# EAGLE design MRCS-Tiny-Servo-Pots (EAGLE 7.7.0)
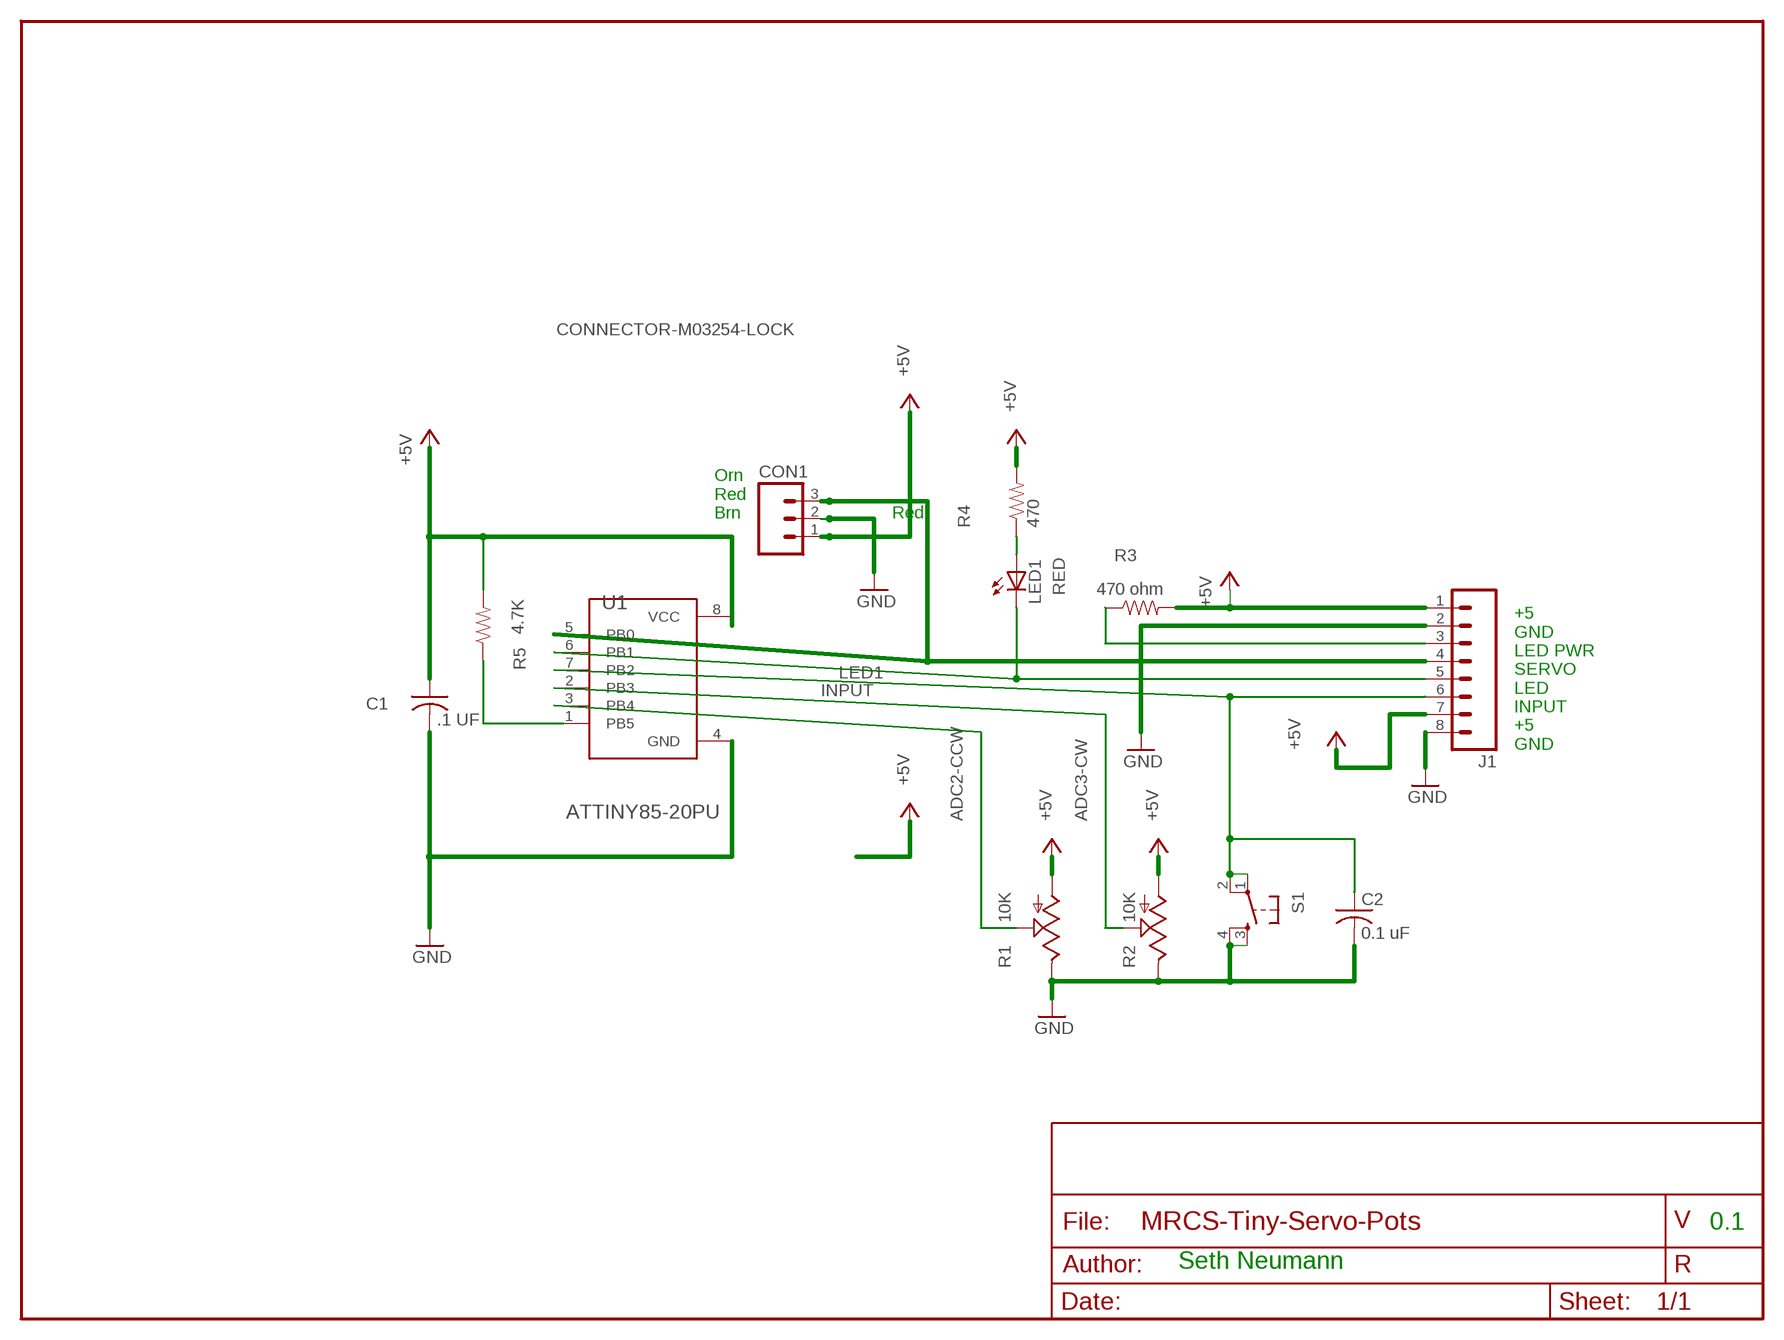
[diagram p0: schematic, sheet 1]

## Parts
C1  .1 UF  CAPPTH2  [C-PTH-0.100]
C2  0.1 uF  CAPPTH2  [C-PTH-0.100]
CON1  CONNECTOR-M03254-LOCK  [3POL254]
J1  CONNECTOR-M08LOCK  [1X08_LOCK]
LED1  RED  LEDLED3MM  [LED3MM]
R1  10K  TRIM_US-RS3  [RS3]
R2  10K  TRIM_US-RS3  [RS3]
R3  470 ohm  RPTH04  [AXIAL-0.4-RES]
R4  470  RPTH04  [AXIAL-0.4-RES]
R5  4.7K  RPTH04  [AXIAL-0.4-RES]
S1  TAC_SWITCHPTH  [TACTILE-PTH]
U1  ATTINY85-20PU  [DIP762W46P254L927H533Q8B]

## Nets
+5V: C1.1 CON1.1 J1.1 J1.7 R1.A R2.A R3.P$2 R4.P$2 R5.P$2
ADC2-CCW: R1.S U1.3(PB4)
ADC3-CW: R2.S U1.2(PB3)
GND: C1.2 C2.2 CON1.2 J1.2 J1.8 R1.E R2.E S1.3 S1.4 U1.4(GND)
INPUT: C2.1 J1.6 S1.1 S1.2 U1.7(PB2)
LED1: J1.5 LED1.K(C) U1.6(PB1)
N$1: J1.3 R3.P$1
N$2: LED1.A R4.P$1
N$3: R5.P$1
N$4: CON1.3 J1.4 U1.5(PB0)
Unconnected: U1.1(PB5)

## Notes on the sheet
- Orn
  Red
  Brn
- Red
- +5
  GND
  LED PWR
  SERVO
  LED
  INPUT
  +5
  GND
- 0.1
- Seth Neumann

## Power pins joined to a net without a drawn wire
VCC: U1.8(VCC)

## Library data of the parts
C1 C2 = SPCoast:CAP*
CON1 = SPCoast:CONNECTOR-M03
J1 = SPCoast:CONNECTOR-M08: Header 8 Standard 8-pin 0.1" header. Use with straight break away headers (SKU : PRT-00116), right angle break away headers (PRT-00553), swiss pins (PRT-00743), machine pins (PRT-00117), and female headers (PRT-00115).
LED1 = SPCoast:LED*
R1 R2 = pot:TRIM_US-: POTENTIOMETER
R3-R5 = SPCoast:R*: Resistor Basic schematic elements and footprints for 0603, 1206, and PTH 1/10th watt (small) resistors.
S1 = SparkFun-Electromechanical:TAC_SWITCH: Momentary Switch Button commonly used for reset or general input. Spark Fun Electronics SKU : COM-00097 SMT- SWCH-08247
U1 = ATTINY85-20PU:ATTINY85-20PU: ATtiny Series 20 MHz 8 KB Flash 512 B SRAM 8-Bit Microcontroller - DIP-8 Check availability <https://pricing.snapeda.com/parts/ATTINY85-20PU/Microchip%20Technology%20/%20Atmel/view-part?ref=eda>; AVAILABILITY: In Stock; DESCRIPTION: AVR AVR® ATtiny, Functional Safety (FuSa) Microcontroller IC 8-Bit 20MHz 8KB (4K x 16) FLASH 8-PDIP; MF: Microchip Technology / Atmel; MP: ATTINY85-20PU; PACKAGE: None; PRICE: None; PURCHASE-URL: https://pricing.snapeda.com/search/part/ATTINY85-20PU/?ref=eda

## Board
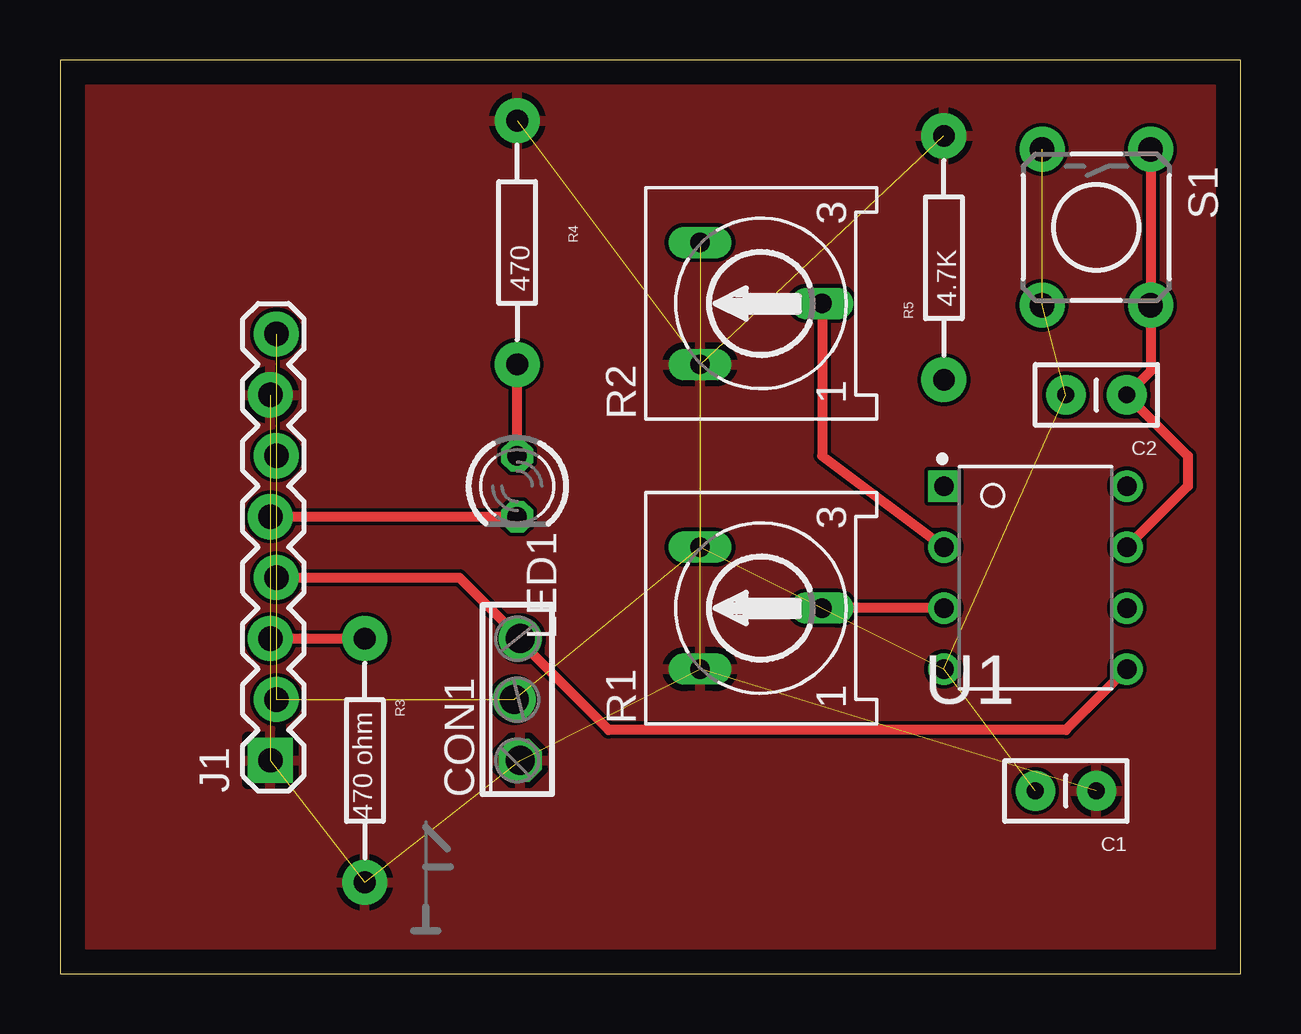
[diagram p1: board, top side]
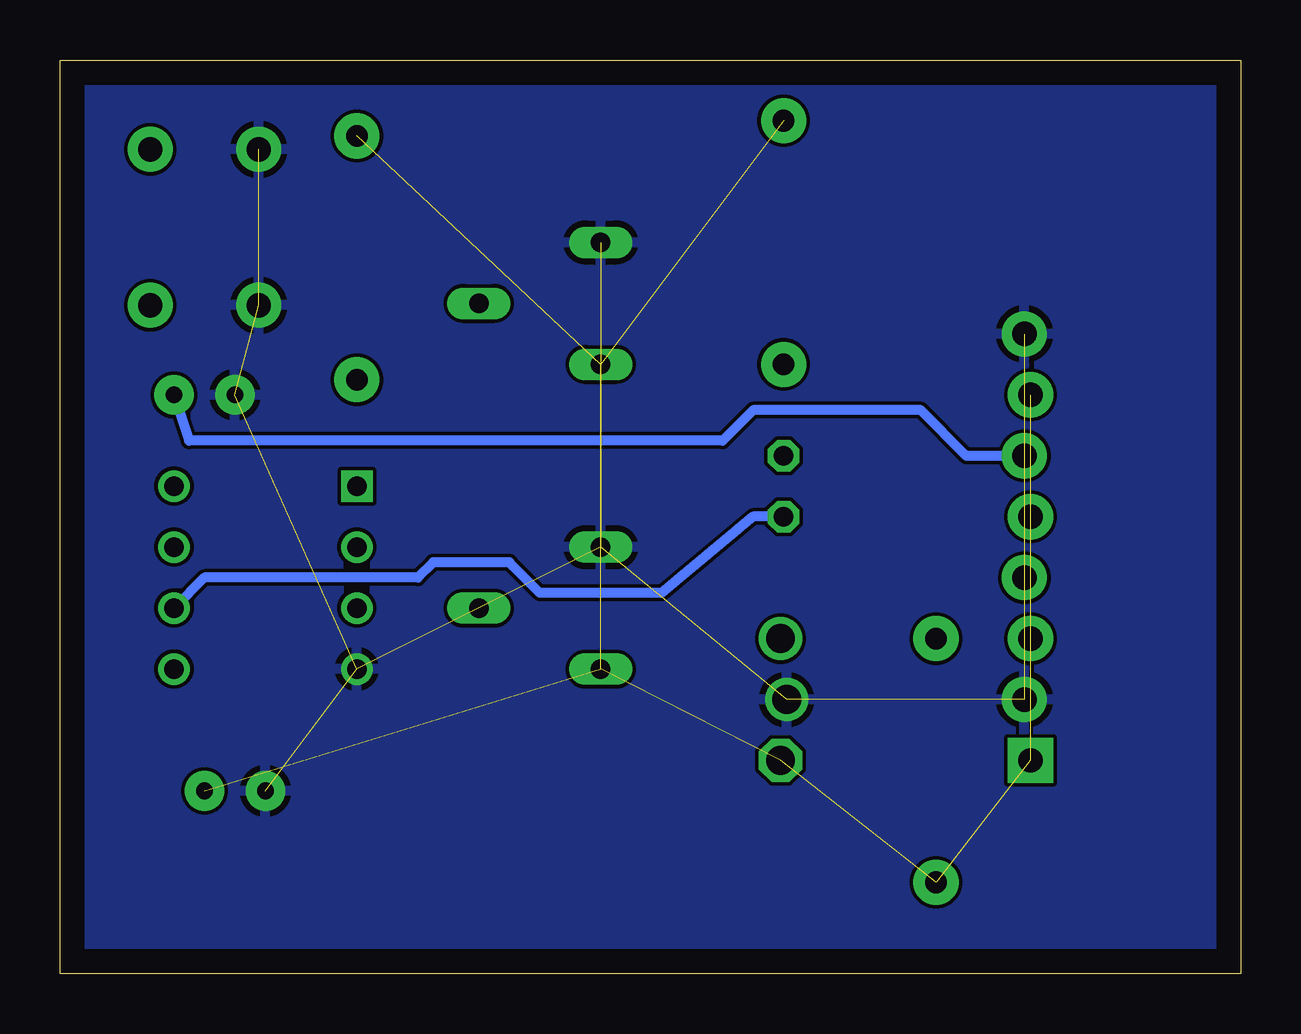
[diagram p2: board, bottom side, seen from below]

Size 49.2 x 38.09 mm. Coordinates in mm from the lower left corner, seen from the top.
Outline: 0,0 49.2,0 49.2,38.09 0,38.09 0,0
Copper layers (1*16): Top 0.035mm / dielectric 1.5mm / Bottom 0.035mm
Design rules "default": minimum track width 6mil, minimum drill 0.35mm, track to track 6mil, track to pad 6mil, pad to pad 6mil, via to via 6mil, smd to smd 6mil, copper to edge 40mil, drill to drill 6mil, minimum pad ring 10mil, minimum via ring 8mil, stop-mask expansion 4mil, vias tented up to drill 0mil, thermal gap 10mil

### Footprints (pad centres in the part's own frame; a part is rotated, then mirrored left to right if it is on the bottom)
C-PTH-0.100 = drill 0.7 pad 1.651: 1 -1.27,0; 2 1.27,0
3POL254 = drill 1.2 octagon: 1 -2.54,-0.127 | drill 1.2: 2 0,0.127; 3 2.54,-0.127
1X08_LOCK = drill 1.016 pad 1.88 square: 1 0,0.127 | drill 1.016 pad 1.88: 2 2.54,-0.127; 3 5.08,0.127; 4 7.62,-0.127; 5 10.16,0.127; 6 12.7,-0.127; 7 15.24,0.127; 8 17.78,-0.127
LED3MM = drill 0.813 octagon: A 1.27,0; K -1.27,0
RS3 = drill 0.813 long: A -2.54,2.54; E 2.54,2.54; S 0,-2.54
AXIAL-0.4-RES = drill 0.9 pad 1.88: P$1 -5.08,0; P$2 5.08,0
TACTILE-PTH = drill 1.016 pad 1.88: 1 -3.251,2.261; 2 3.251,2.261; 3 -3.251,-2.261; 4 3.251,-2.261
DIP762W46P254L927H533Q8B = drill 0.813 square: 1 -3.81,3.81 | drill 0.813: 2 -3.81,1.27; 3 -3.81,-1.27; 4 -3.81,-3.81; 5 3.81,-3.81; 6 3.81,-1.27; 7 3.81,1.27; 8 3.81,3.81

### Placement (x,y rotation side)
C1  41.91,7.62 180 top
C2  43.18,24.13 180 top
CON1  19.05,11.43 90 top
J1  8.89,8.89 90 top
LED1  19.05,20.32 90 top
R1  29.21,15.24 90 top
R2  29.21,27.94 90 top
R3  12.7,8.89 270 top
R4  19.05,30.48 90 top
R5  36.83,29.84 90 top
S1  43.18,31.11 270 top
U1  40.64,16.51 0 top
U$1  [MRCSLOGOTOP]  13.97,1.27 0 top

### Tracks (layer width: path | path; a pad name or v marks a point on that pad's centre or on a via)
+5V  (8 unrouted)
  pour Top: 0,0 49.53,0 49.53,38.1 0,38.1
ADC2-CCW
  Top 0.406: U1.3 R1.S
ADC3-CW
  Top 0.406: R2.S 31.75,21.59 U1.2
GND  (9 unrouted)
  pour Bottom: 0,0 49.53,0 49.53,38.1 0,38.1
INPUT
  Top 0.406: S1.1 S1.2 45.44,25.12 C2.1 46.99,21.59 46.99,20.32 U1.7
  Bottom 0.406: J1.6 11.43,21.59 13.34,23.5 20.32,23.5 21.59,22.23 43.81,22.23 C2.1
LED1
  Top 0.406: J1.5 LED1.K
  Bottom 0.406: LED1.K 20.32,19.05 24.13,15.88 29.21,15.88 30.48,17.14 33.66,17.14 34.29,16.51 43.18,16.51 U1.6
N$1
  Top 0.406: J1.3 R3.P$1
N$2
  Top 0.406: LED1.A R4.P$1
N$4
  Top 0.406: J1.4 16.64,16.51 CON1.3 19.18,13.84 22.86,10.16 41.91,10.16 U1.5

### Text on the board
tDocu: Seth Neumann / 20220319 | Tiny85 Servo V1.0 | GND / +5 / IN / LED / SER / LP / GND / +5